# EAGLE board Primary (EAGLE 5.12), part 1 of 2
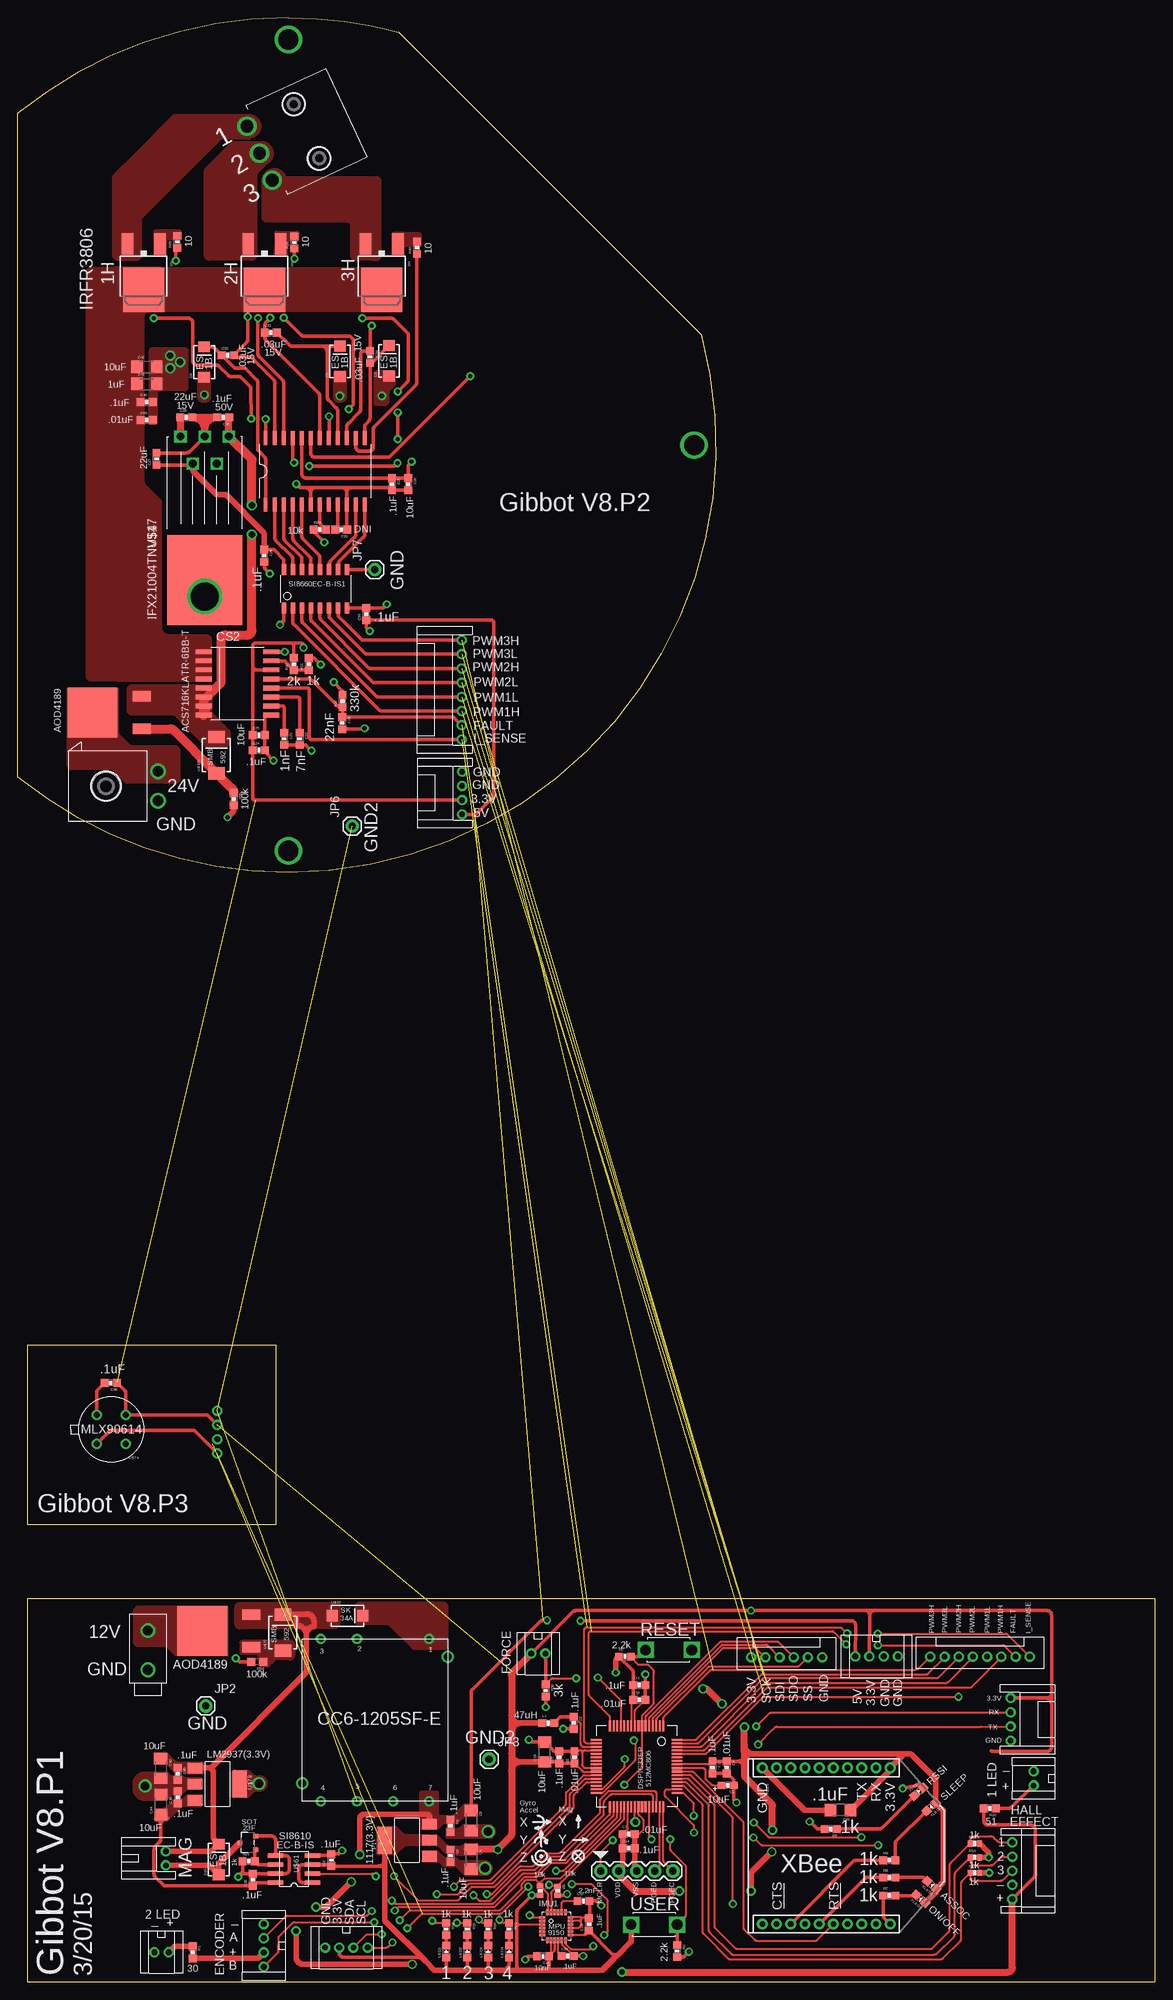
[diagram p4: board, top side]
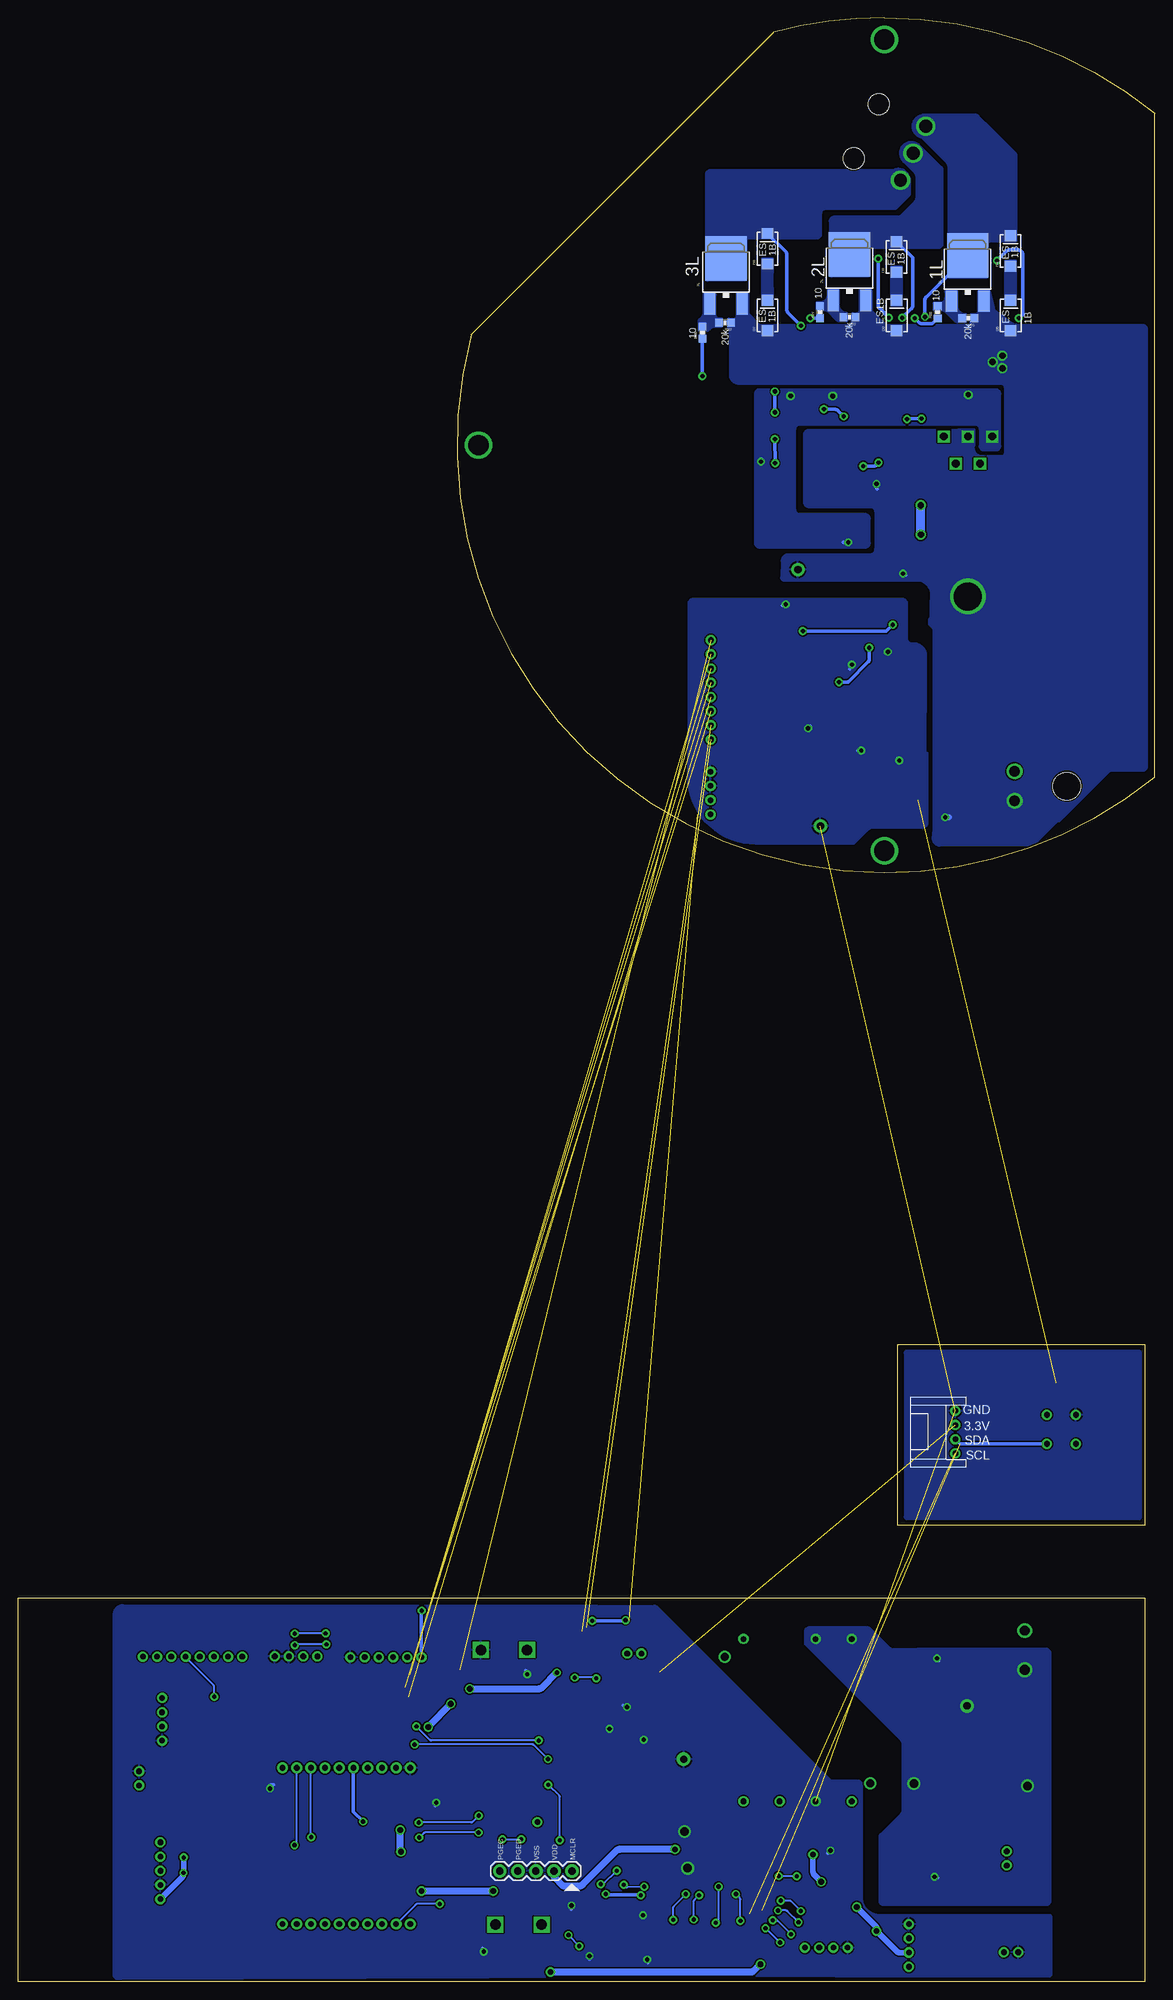
[diagram p5: board, bottom side, seen from below]

Size 160.13 x 276.63 mm. Coordinates in mm from the lower left corner, seen from the top.
Outline: 1.38,64.33 1.38,89.73 36.3,89.73 36.3,64.33 1.38,64.33
Outline: 1.38,0 1.38,53.98 160.13,53.98 160.13,0 1.38,0
Outline: 38.1,276.63 arc-15 53.68,274.58 96.25,232.02 arc-105 38.1,156.24 arc-39 0,169.7 0,263.17 arc-39 38.1,276.63
Copper layers (1*16): Top 0.035mm / dielectric 1.5mm / Bottom 0.035mm
Design rules "default *": minimum track width 8mil, minimum drill 20mil, track to track 8mil, track to pad 8mil, pad to pad 5mil, via to via 8mil, smd to smd 5mil, copper to edge 10mil, drill to drill 8mil, minimum pad ring 12mil, minimum via ring 10mil, stop-mask expansion 4mil, vias tented up to drill 0mil, thermal gap 10mil

## Footprints (pad centres in the part's own frame; a part is rotated, then mirrored left to right if it is on the bottom)
DPAK = smd 5.791 x 6.274: D 0,1.587 | smd 1.6 x 3: G -2.286,-4.851; S 2.286,-4.851
0603-POL = smd 1.1 x 1: + 0.85,0; - -0.85,0
0603 = smd 1.1 x 1.1: 1 -0.85,0; 2 0.85,0
1206 = smd 1.6 x 1.8: 1 -1.4,0; 2 1.4,0
SOIC16-W = smd 0.65 x 2.25: 1 -4.445,-4.75; 2 -3.175,-4.75; 3 -1.905,-4.75; 4 -0.635,-4.75; 5 0.635,-4.75; 6 1.905,-4.75; 7 3.175,-4.75; 8 4.445,-4.75; 9 4.445,4.75; 10 3.175,4.75; 11 1.905,4.75; 12 0.635,4.75; 13 -0.635,4.75; 14 -1.905,4.75; 15 -3.175,4.75; 16 -4.445,4.75
SMA-DIODE = smd 1.52 x 1.63: A -2.15,0; C 2.15,0
LGA24_4X4 = smd 0.8 x 0.35: 1 -2,1.25; 2 -2,0.75; 3 -2,0.25; 4 -2,-0.25; 5 -2,-0.75; 6 -2,-1.25; 13 2,-1.25; 14 2,-0.75; 15 2,-0.25; 16 2,0.25; 17 2,0.75; 18 2,1.25 | smd 0.35 x 0.85: 7 -1.25,-1.975; 8 -0.75,-1.975; 9 -0.25,-1.975; 10 0.25,-1.975; 11 0.75,-1.975; 12 1.25,-1.975; 19 1.25,1.975; 20 0.75,1.975; 21 0.25,1.975; 22 -0.25,1.975; 23 -0.75,1.975; 24 -1.25,1.975
1X01_TEST = drill 0.762 round: 1 0,0
1X01 = drill 1.016 pad 1.88 round: 1 0,0
JST-4-PH-TH = drill 0.8 round: 1 -3,-6.35; 2 -1,-6.35; 3 1,-6.35; 4 3,-6.35
JST-4-PH-V = drill 0.8 round: 1 -3,0; 2 -1,0; 3 1,0; 4 3,0
MOLEX-2-MINIFITJR-V2 = drill 1.397 round: P$1 0,0; P$2 0,5.512
JST-2-PH-V = drill 0.8 round: 1 -1,0; 2 1,0
JST-2-PH-TH = drill 0.8 round: 1 -1,-6.35; 2 1,-6.35
MOLEX-3-MINIFITJR-RA = drill 1.803 round: 1 4.191,13.538; 2 0,13.538; 3 -4.191,13.538 | hole 3: -4.204,6.248; 4.204,6.248
TE-MINIMATENLOK-2 = drill 1.48 round: 1 -2.07,12.67; 2 2.07,12.67 | hole 3.91: 0,5.33
0603-DIODE = smd 1.1 x 1.1: AN -0.85,0; CAT 0.85,0
SOT23F = smd 0.6 x 0.65: D 0,1.125; G -0.95,-1.125; S 0.95,-1.125
SOIC24-W = smd 0.533 x 1.981: 1 -6.985,-4.686; 2 -5.715,-4.686; 3 -4.445,-4.686; 4 -3.175,-4.686; 5 -1.905,-4.686; 6 -0.635,-4.686; 7 0.635,-4.686; 8 1.905,-4.686; 9 3.175,-4.686; 10 4.445,-4.686; 11 5.715,-4.686; 12 6.985,-4.686; 13 6.985,4.686; 14 5.715,4.686; 15 4.445,4.686; 16 3.175,4.686; 17 1.905,4.686; 18 0.635,4.686; 19 -0.635,4.686; 20 -1.905,4.686; 21 -3.175,4.686; 22 -4.445,4.686; 23 -5.715,4.686; 24 -6.985,4.686
SOT223 = smd 1.499 x 2.007: 1 -2.261,-3.15; 2 0.025,-3.15; 3 2.311,-3.15 | smd 3.81 x 2.007: 4 0,3.15
CC6-2405SF-E = drill 0.8 round: 1 -11.43,7.62; 2 -11.43,-2.54; 3 -11.43,-7.62; 4 11.43,-7.62; 5 11.43,-2.54; 6 11.43,2.54; 7 11.43,7.62 | drill 1.1 round: P$9 8.89,-10.25; P$10 -8.89,10.25
1X05-PICKIT3 = drill 1.016 pad 1.88 round: MCLR 1.27,-1.016; PGEC 11.43,-1.016; PGED 8.89,-1.016; VDD 3.81,-1.016; VSS 6.35,-1.016
0402 = smd 0.7 x 0.9: 1 -0.65,0; 2 0.65,0
TACTILE_SWITCH = drill 1.5 square: 1 -3.25,0; 2 3.25,0
TQFP64_10X10 = smd 1.5 x 0.3: 1 -5.7,3.75; 2 -5.7,3.25; 3 -5.7,2.75; 4 -5.7,2.25; 5 -5.7,1.75; 6 -5.7,1.25; 7 -5.7,0.75; 8 -5.7,0.25; 9 -5.7,-0.25; 10 -5.7,-0.75; 11 -5.7,-1.25; 12 -5.7,-1.75; 13 -5.7,-2.25; 14 -5.7,-2.75; 15 -5.7,-3.25; 16 -5.7,-3.75; 33 5.7,-3.75; 34 5.7,-3.25; 35 5.7,-2.75; 36 5.7,-2.25; 37 5.7,-1.75; 38 5.7,-1.25; 39 5.7,-0.75; 40 5.7,-0.25; 41 5.7,0.25; 42 5.7,0.75; 43 5.7,1.25; 44 5.7,1.75; 45 5.7,2.25; 46 5.7,2.75; 47 5.7,3.25; 48 5.7,3.75 | smd 0.3 x 1.5: 17 -3.75,-5.7; 18 -3.25,-5.7; 19 -2.75,-5.7; 20 -2.25,-5.7; 21 -1.75,-5.7; 22 -1.25,-5.7; 23 -0.75,-5.7; 24 -0.25,-5.7; 25 0.25,-5.7; 26 0.75,-5.7; 27 1.25,-5.7; 28 1.75,-5.7; 29 2.25,-5.7; 30 2.75,-5.7; 31 3.25,-5.7; 32 3.75,-5.7; 49 3.75,5.7; 50 3.25,5.7; 51 2.75,5.7; 52 2.25,5.7; 53 1.75,5.7; 54 1.25,5.7; 55 0.75,5.7; 56 0.25,5.7; 57 -0.25,5.7; 58 -0.75,5.7; 59 -1.25,5.7; 60 -1.75,5.7; 61 -2.25,5.7; 62 -2.75,5.7; 63 -3.25,5.7; 64 -3.75,5.7
JST-6-PH-V = drill 0.8 round: 1 -5,0; 2 -3,0; 3 -1,0; 4 1,0; 5 3,0; 6 5,0
SOIC16-N = smd 0.6 x 1.55: 1 -4.445,-2.7; 2 -3.175,-2.7; 3 -1.905,-2.7; 4 -0.635,-2.7; 5 0.635,-2.7; 6 1.905,-2.7; 7 3.175,-2.7; 8 4.445,-2.7; 9 4.445,2.7; 10 3.175,2.7; 11 1.905,2.7; 12 0.635,2.7; 13 -0.635,2.7; 14 -1.905,2.7; 15 -3.175,2.7; 16 -4.445,2.7
TO220-5 = drill 1.1 square: 1 3.81,-3.404; 2 0,-1.702; 3 3.81,0; 4 0,1.702; 5 3.81,3.404 | smd 12.7 x 10.541: PAD -16.434,0 | drill 3.937 round: PAD2 -18.72,0
SOIC8-N = smd 2.2 x 0.6: 1 -2.6,1.905; 2 -2.6,0.635; 3 -2.6,-0.635; 4 -2.6,-1.905; 5 2.6,-1.905; 6 2.6,-0.635; 7 2.6,0.635; 8 2.6,1.905
4-40 = drill 2.845 round: P$1 0,0
MLX90614 = drill 0.8 round: SCL 2.051,2.051; SDA -2.051,2.051; VDD -2.051,-2.051; VSS 2.051,-2.051
D-PAK = smd 7.01 x 7.01: D 0,0 | smd 1.499 x 2.515: G -2.286,-6.909; S 2.286,-6.909
SMB-DIODE = smd 1.75 x 2.3: A -2.54,0; C 2.54,0
JST-5-PH = drill 0.8 round: 1 -4,0; 2 -2,0; 3 0,0; 4 2,0; 5 4,0
JST-8-PH-V = drill 0.8 round: 1 -7,0; 2 -5,0; 3 -3,0; 4 -1,0; 5 1,0; 6 3,0; 7 5,0; 8 7,0
JST-8-PH-TH = drill 0.8 round: 1 -7,-6.35; 2 -5,-6.35; 3 -3,-6.35; 4 -1,-6.35; 5 1,-6.35; 6 3,-6.35; 7 5,-6.35; 8 7,-6.35
XBEE-SILK = drill 0.8 pad 1.524 round: 1 -11,20; 2 -11,18; 3 -11,16; 4 -11,14; 5 -11,12; 6 -11,10; 7 -11,8; 8 -11,6; 9 -11,4; 10 -11,2; 11 11,2; 12 11,4; 13 11,6; 14 11,8; 15 11,10; 16 11,12; 17 11,14; 18 11,16; 19 11,18; 20 11,20

## Placement (x,y rotation side)
1H  IRFR3806  [DPAK]  17.73,239.9 180 top
1L  IRFR3806  [DPAK]  26.37,241.56 0 bottom
2H  IRFR3806  [DPAK]  34.75,239.9 180 top
2L  IRFR3806  [DPAK]  43,241.68 0 bottom
3H  IRFR3806  [DPAK]  51.26,239.9 180 top
3L  IRFR3806  [DPAK]  60.4,241.17 0 bottom
C1  10uF  [0603-POL]  99.98,27.69 180 top
C2  .1uF  [0603]  78.3,36.49 270 top
C3  .1uF  [0603]  60.93,17.77 270 top
C4  10uF  [1206]  63.85,17.26 270 top
C5  10uF  [1206]  63.85,22.72 270 top
C6  .1uF  [0603]  60.93,21.96 270 top
C7  .01uF  [0603]  86.04,20.82 0 top
C8  .01uF  [0603]  78.39,31.62 90 top
C9  .01uF  [0603]  99.85,30.23 270 top
C10  .01uF  [0603]  87.52,39.71 0 top
C11  .1uF  [0603]  87.54,41.78 0 top
C12  .1uF  [0603]  97.82,30.23 270 top
C13  .1uF  [0603]  76.23,31.62 90 top
C14  .1uF  [0603]  86.04,18.8 0 top
C15  10uF  [1206]  74.2,32.38 90 top
C16  .1uF  [0603]  80.42,8.08 90 top
C17  2.2nF  [0603]  79.66,11.38 0 top
C18  10nF  [0603]  73.96,3.61 180 top
C19  .1uF  [0603]  77.44,3.63 0 top
C20  .1uF  [1206]  115.87,24.18 180 top
C21  1nF  [0603]  37.53,175.07 270 top
C22  7nF  [0603]  39.69,175.07 270 top
C23  22nF  [0603]  45.71,177.27 270 top
C24  .1uF  [0603]  33.96,173.45 0 top
C25  10uF  [0603]  33.96,175.58 0 top
C26  .1uF 48V  [0603]  28.93,220.33 180 top
C27  22uF  [0603]  19.54,214.49 90 top
C28  22uF 15V  [0603]  23.73,220.33 0 top
C29  .1uF  [0603]  34.71,200.85 270 top
C30  .1uF  [0603]  49.07,192.64 90 top
C31  DNI  [0603]  45.57,204.54 180 top
C32  .03uF 15V  [0603]  29.59,229.08 0 top
C33  .03uF 15V  [0603]  35.64,232.28 0 top
C34  .03uF 15V  [0603]  49.61,228.86 270 top
C35  .1uF  [0603]  52.69,210.95 270 top
C36  10uF  [0603]  54.98,210.95 270 top
C37  .1uF  [0603]  44.14,17.15 90 top
C38  .1uF  [0603]  33.08,14.35 90 top
C39  .01uF  [0603]  18.18,219.97 0 top
C40  .1uF  [0603]  18.18,222.51 0 top
C41  1uF  [1206]  18.18,225.05 0 top
C42  10uF  [1206]  18.18,227.46 0 top
C43  10uF  [1206]  20.15,30.06 270 top
C44  10uF  [1206]  20.16,24.96 90 top
C45  .1uF  [0603]  22.54,29.27 270 top
C46  .1uF  [0603]  22.52,26 90 top
C48  .1uF  [0603]  13.11,84.35 180 top
CS2  ACS716KLATR-6BB-T  [SOIC16-W]  30.94,182.86 270 top
D1  ES1B  [SMA-DIODE]  52.28,228.31 90 top
D2  ES1B  [SMA-DIODE]  45.39,228.22 90 top
D3  ES1B  [SMA-DIODE]  26.25,228.12 90 top
D4  ES1B  [SMA-DIODE]  20.33,243.79 90 bottom
D5  ES1B  [SMA-DIODE]  20.31,234.72 90 bottom
D6  ES1B  [SMA-DIODE]  54.56,244.1 90 bottom
D7  ES1B  [SMA-DIODE]  54.56,234.72 90 bottom
D8  ES1B  [SMA-DIODE]  36.4,242.95 90 bottom
D9  ES1B  [SMA-DIODE]  36.36,234.72 90 bottom
D10  ES1B  [SMA-DIODE]  28.3,17.23 90 top
IMU1  MPU-9150  [LGA24_4X4]  75.85,7.82 0 top
JP1  M01TEST  [1X01_TEST]  86.96,22.48 0 top
JP2  GND  [1X01]  26.47,38.85 0 top
JP3  GND2  [1X01]  66.36,31.34 0 top
JP4  [JST-4-PH-TH]  146.15,36.96 270 top
JP5  [JST-4-PH-V]  34.64,5.12 270 top
JP6  GND2  [1X01]  47.1,162.78 90 top
JP7  GND1  [1X01]  50.27,198.91 90 top
JP8  [JST-4-PH-V]  120.94,45.83 0 top
JP9  [JST-4-PH-TH]  56.23,167.43 90 top
JP10  [MOLEX-2-MINIFITJR-V2]  18.33,43.95 0 top
JP11  [JST-2-PH-V]  143.03,28.65 270 top
JP12  [JST-2-PH-V]  73.3,46.24 0 top
JP13  [JST-2-PH-V]  20.25,4.17 0 top
JP14  [JST-2-PH-TH]  14.51,17.37 90 top
JP15  [MOLEX-3-MINIFITJR-RA]  46.32,263.27 115 top
JP16  [JST-4-PH-V]  46.27,4.81 0 top
JP17  [TE-MINIMATENLOK-2]  7.08,168.41 270 top
JP18  [JST-4-PH-TH]  34.45,77.42 90 bottom
L1  47uH  [0603]  74.71,36.45 0 top
LED1  [0603-DIODE]  60.35,4.25 90 top
LED2  [0603-DIODE]  63.32,4.25 90 top
LED3  [0603-DIODE]  66.24,4.25 90 top
LED4  [0603-DIODE]  69.18,4.25 90 top
M1  N-MOSSOT23F  [SOT23F]  32.39,19.58 90 top
MD1  HIP4086  [SOIC24-W]  41.89,212.75 0 top
P1  LINEAR-REG1117  [SOT223]  54.83,19.93 90 top
P2  DC-DC-CONVERTER1.2A  [CC6-2405SF-E]  50.31,36.86 270 top
PROG  [1X05-PICKIT3]  80.82,16.61 0 top
PROG1  [1X05-PICKIT3]  80.82,14.58 180 bottom
R1  30  [0603]  24.63,4.17 270 top
R2  2.2k  [0603]  85.5,45.8 0 top
R3  2.2k  [0603]  92.86,4.33 270 top
R4  10k  [0402]  73.55,12.84 270 top
R5  10k  [0402]  76.03,12.81 270 top
R6  1k  [0603]  114.49,21.51 180 top
R7  1k  [0603]  122.71,12.14 0 top
R8  1k  [0603]  122.71,14.68 0 top
R9  1k  [0603]  122.73,17.11 0 top
R10  2k  [0603]  38.88,185.61 90 top
R11  1k  [0603]  40.99,185.6 90 top
R12  330k  [0603]  45.73,180.39 90 top
R13  1k  [0402]  134.78,15.34 0 top
R14  1k  [0402]  134.78,17.51 0 top
R15  1k  [0402]  134.78,19.47 0 top
R18  1k  [0603]  60.35,7.43 270 top
R19  1k  [0603]  63.32,7.43 270 top
R20  1k  [0603]  66.24,7.43 270 top
R21  1k  [0603]  69.18,7.43 270 top
R22  51  [0603]  136.88,24.43 180 top
R23  1k  [0603]  32.51,16.98 0 top
R24  10k  [0603]  42.52,204.54 0 top
R25  10  [0603]  22.44,245.06 90 top
R26  10  [0603]  30.6,235.14 90 bottom
R27  10  [0603]  47.17,235.17 90 bottom
R28  10  [0603]  63.69,232.27 90 bottom
R29  10  [0603]  38.94,244.98 90 top
R30  10  [0603]  56.21,244.22 90 top
R31  20k  [0603]  26.29,234.3 180 bottom
R32  20k  [0603]  43,234.44 180 bottom
R33  20k  [0603]  60.53,233.68 180 bottom
R34  100k  [0603]  33.74,45.05 180 top
R35  100k  [0603]  30.41,166.59 270 top
R36  3k  [0603]  74.34,41.02 270 top
RESET1  TACTILE_SWITCH  [TACTILE_SWITCH]  91.66,46.74 0 top
U$1  DSPIC33EP512MC806  [TQFP64_10X10]  87.15,30.35 270 top
U$38  JST-6-PH-V  [JST-6-PH-V]  108.27,45.71 0 top
U$46  DIGITAL-ISOLATOR-6CHSI8660EC-B-IS1  [SOIC16-N]  41.92,196.19 0 top
U$47  IFX21004TNV51  [TO220-5]  26.33,213.84 90 top
U$61  DIGITAL-ISOLATOR-1CHSOIC8-N  [SOIC8-N]  38.92,15.87 180 top
U$64  4-40  [4-40]  95.25,216.44 0 top
U$65  4-40  [4-40]  38.1,159.28 0 top
U$66  4-40  [4-40]  38.1,273.58 0 top
U$74  MLX90614  [MLX90614]  13.16,77.8 180 top
U$75  AOD4189  [D-PAK]  25.99,49.42 90 top
U$77  10V  [SMB-DIODE]  37.33,49.17 90 top
U$78  SK34A  [SMA-DIODE]  46.43,51.55 0 top
U$79  LINEAR-REGLM2937  [SOT223]  28.13,27.85 270 top
U$82  JST-5-PH  [JST-5-PH]  140.05,15.63 270 top
U$84  JST-8-PH-V  [JST-8-PH-V]  135.5,45.8 0 top
U$88  MO8JST-PH-TH  [JST-8-PH-TH]  56.18,181.97 90 top
U$98  AOD4189  [D-PAK]  10.53,178.75 90 top
U$100  10V  [SMB-DIODE]  27.99,172.78 90 top
USER1  TACTILE_SWITCH  [TACTILE_SWITCH]  89.62,8.05 0 top
XBEE  XBEETH  [XBEE-SILK]  102.85,19.13 270 top
XLED1  [0603-DIODE]  127.15,11.67 138 top
XLED2  [0603-DIODE]  128.62,24.64 222 top
XLED3  [0603-DIODE]  128.73,13.59 138 top
XLED4  [0603-DIODE]  126.87,26.77 42 top